# EAGLE design ATTAMI-Shield-serial (EAGLE 7.1.0)
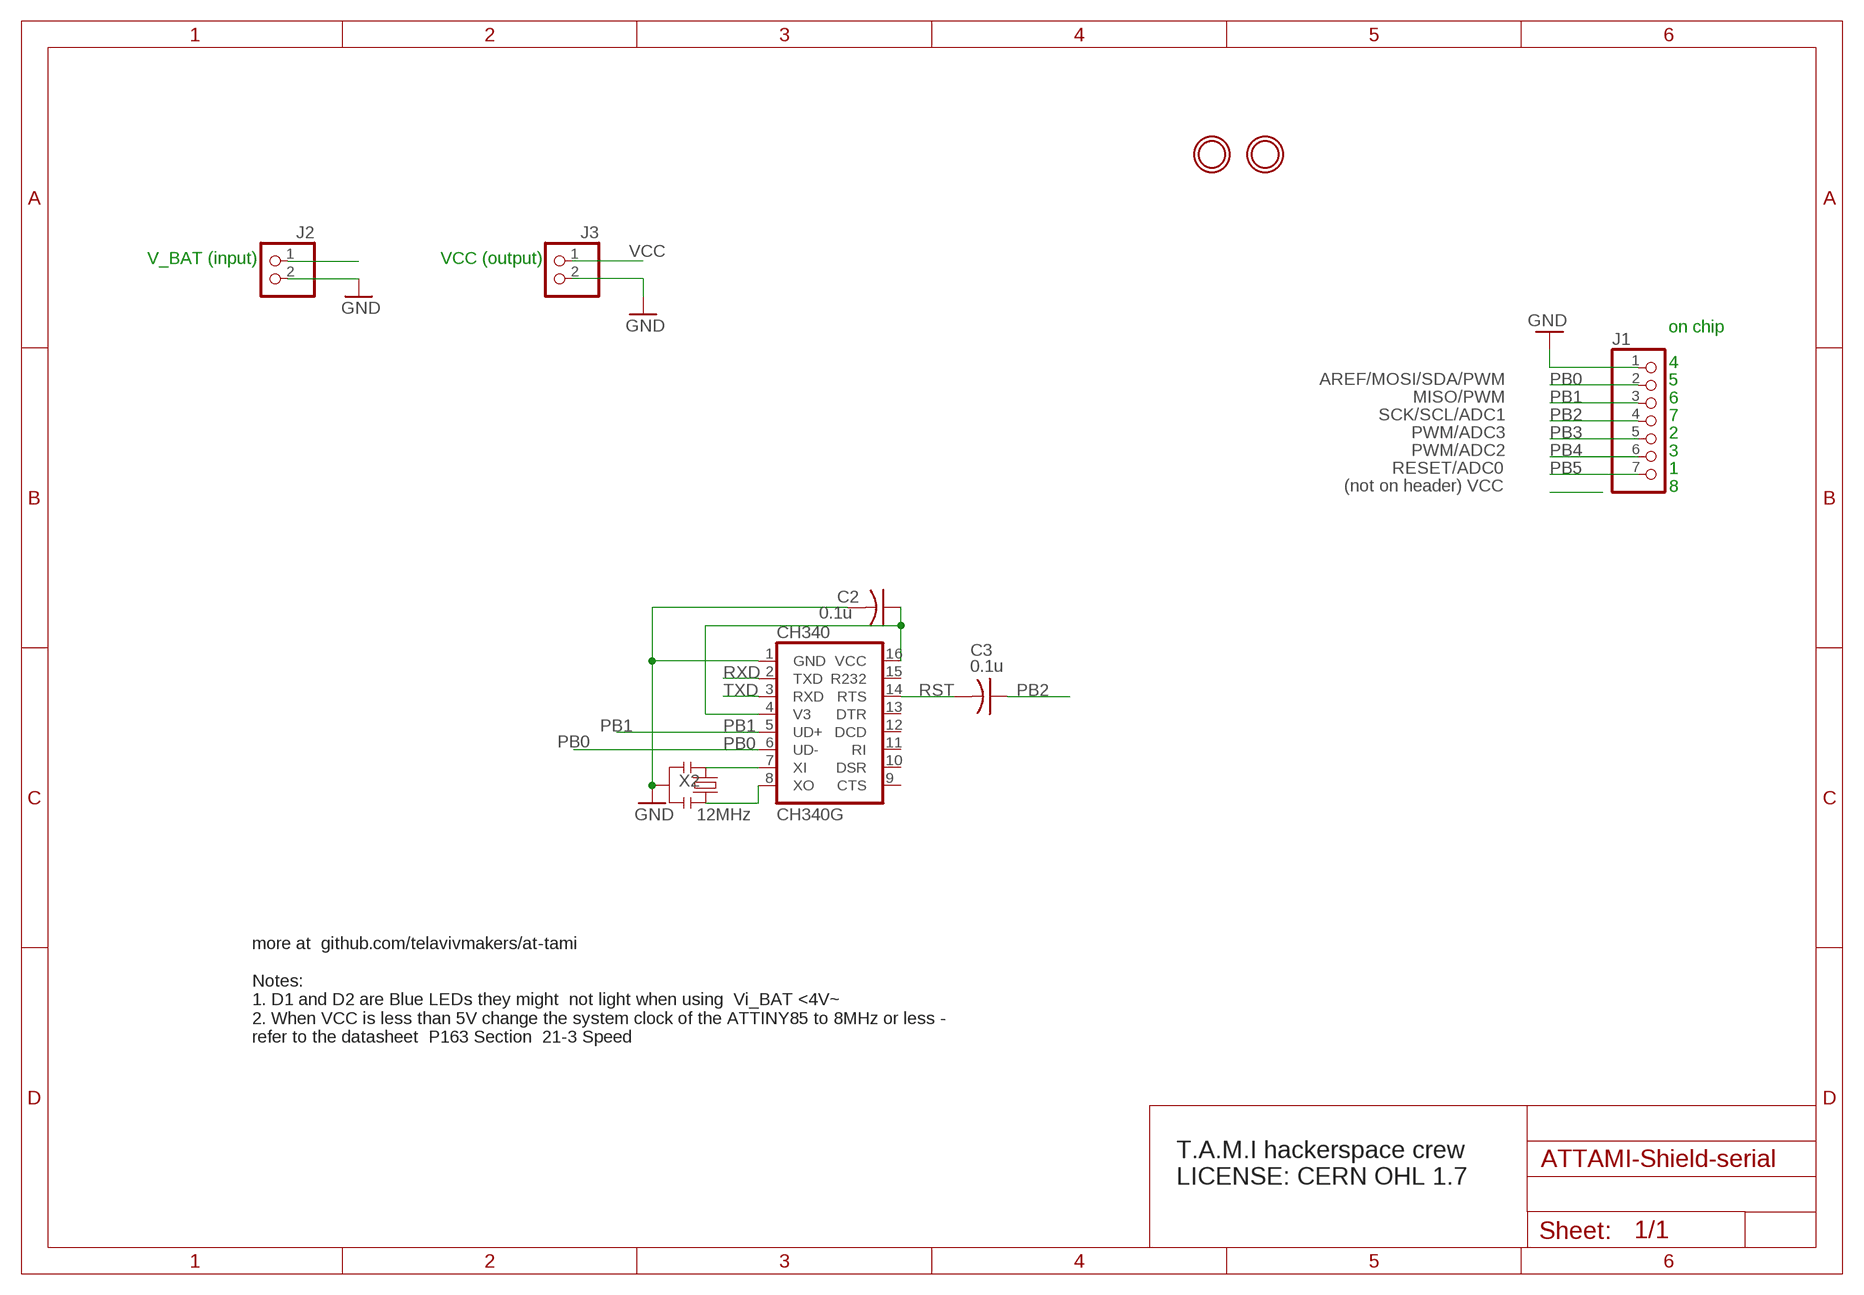
[diagram p0: schematic, sheet 1]

## Parts
C2  0.1u  C-USC0603  [C0603]
C3  0.1u  C-USC0603  [C0603]
CH340  CH340G  [SO16]
J1  HEADER-1X7ROUND  [1X07_ROUND]
J2  HEADER-1X2ROUND  [1X02_ROUND]
J3  HEADER-1X2ROUND  [1X02_ROUND]
U$1  MOUNTINGHOLE2.0  [MOUNTINGHOLE_2.0_PLATED]
U$2  MOUNTINGHOLE2.0  [MOUNTINGHOLE_2.0_PLATED]
X2  12MHz  RESONATORSMD  [RESONATOR-SMD]

## Nets
GND: C2.2 CH340.1(GND) J1.1 J2.2 J3.2 X2.2
N$3: J2.1
N$11: CH340.7(XI) X2.1
N$13: CH340.8(XO) X2.3
PB0: CH340.6(UD-) J1.2
PB1: CH340.5(UD+) J1.3
PB2: C3.1 J1.4
PB3: J1.5
PB4: J1.6
PB5: J1.7
RST: C3.2 CH340.14(RTS)
RXD: CH340.2(TXD)
TXD: CH340.3(RXD)
VCC: C2.1 CH340.4(V3) CH340.16(VCC) J3.1
Unconnected: CH340.9(CTS) CH340.10(DSR) CH340.11(RI) CH340.12(DCD) CH340.13(DTR) CH340.15(R232)

## Notes on the sheet
- V_BAT (input) | VCC (output)
- AREF/MOSI/SDA/PWM
- MISO/PWM
- SCK/SCL/ADC1
- PWM/ADC3
- PWM/ADC2
- RESET/ADC0
- (not on header) VCC
- on chip
  
  4
  5
  6
  7
  2
  3
  1
  8
- more at  github.com/telavivmakers/at-tami
  
  Notes: 
  1. D1 and D2 are Blue LEDs they might  not light when using  Vi_BAT <4V~  
  2. When VCC is less than 5V change the system clock of the ATTINY85 to 8MHz or less - 
  refer to the datasheet  P163 Section  21-3 Speed
- T.A.M.I hackerspace crew 
  LICENSE: CERN OHL 1.7

## Library data of the parts
C2 C3 = adafruit:C-US: CAPACITOR, American symbol
CH340 = SparkFunNew:CH340
J1 = ATtami:HEADER-1X7: PIN HEADER
J2 J3 = ATtami:HEADER-1X2: PIN HEADER
U$1 U$2 = ATtami:MOUNTINGHOLE: Mounting Hole For #2 screws (0.086"/2.18mm width, 0.094"/2.4mm hole) use 2.5mm
X2 = SparkFunNew:RESONATOR: Resonator Small SMD resonator. This is the itty bitty 10/20MHz resonators with built in caps. CSTCE10M0G55 and CSTCE20M0V53. Footprint has been reviewed closely but hasn't been tested yet.

## Net classes
0 default: width 0.178 mm, clearance 0.178 mm
1 power: width 0.305 mm, clearance 0.203 mm

## Board
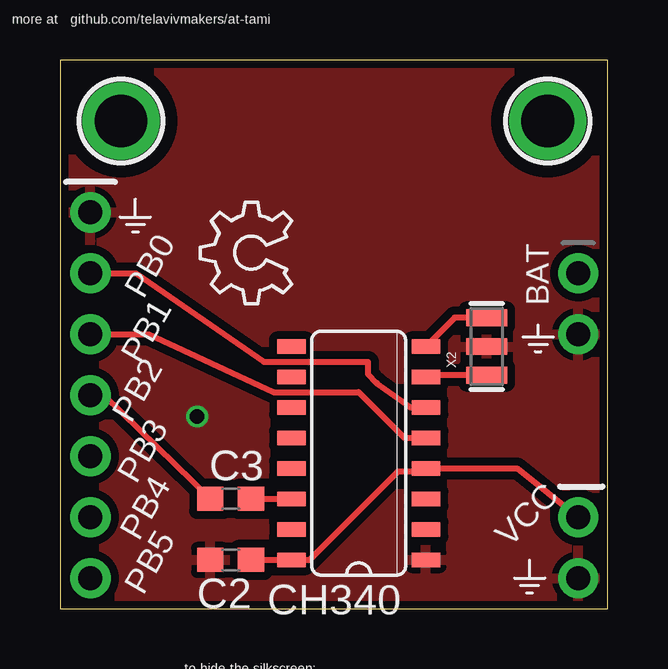
[diagram p1: board, top side]
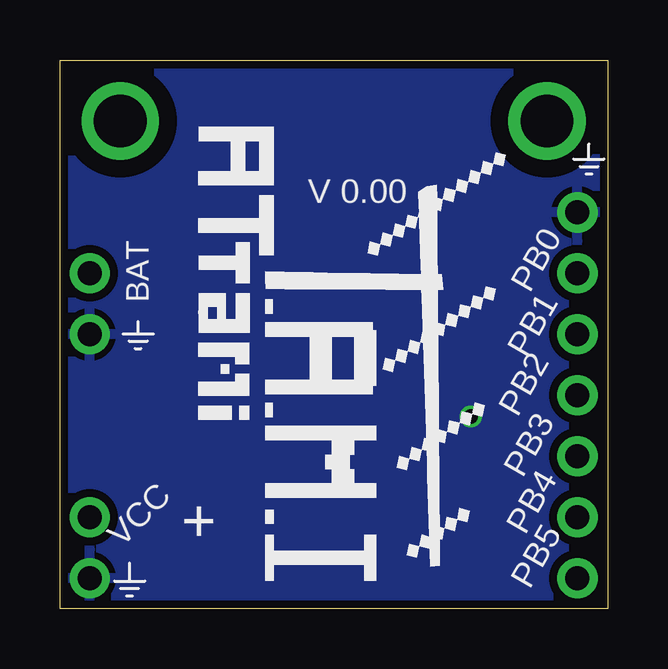
[diagram p2: board, bottom side, seen from below]

Size 22.83 x 22.86 mm. Coordinates in mm from the lower left corner, seen from the top.
Outline: 0,0 22.83,0 22.83,22.86 0,22.86 0,0
Copper layers (1*16): Top 0.035mm / dielectric 1.5mm / Bottom 0.035mm
Design rules "dirt_cheap_dirty_boards.v1": minimum track width 5mil, minimum drill 12mil, track to track 5mil, track to pad 5mil, pad to pad 5mil, via to via 5mil, smd to smd 0mil, copper to edge 10mil, drill to drill 10mil, minimum pad ring 10mil, minimum via ring 6mil, stop-mask expansion 2mil, vias tented up to drill 25mil, thermal gap 10mil

### Footprints (pad centres in the part's own frame; a part is rotated, then mirrored left to right if it is on the bottom)
C0603 = smd 1.1 x 1: 1 -0.85,0; 2 0.85,0
SO16 = smd 0.6 x 1.2: 1 -4.445,-2.8; 2 -3.175,-2.8; 3 -1.905,-2.8; 4 -0.635,-2.8; 5 0.635,-2.8; 6 1.905,-2.8; 7 3.175,-2.8; 8 4.445,-2.8; 9 4.445,2.8; 10 3.175,2.8; 11 1.905,2.8; 12 0.635,2.8; 13 -0.635,2.8; 14 -1.905,2.8; 15 -3.175,2.8; 16 -4.445,2.8
1X07_ROUND = drill 1 pad 1.676: 1 -7.62,0; 2 -5.08,0; 3 -2.54,0; 4 0,0; 5 2.54,0; 6 5.08,0; 7 7.62,0
1X02_ROUND = drill 1 pad 1.676: 1 -1.27,0; 2 1.27,0
MOUNTINGHOLE_2.0_PLATED = drill 2.2 pad 3: P$1 0,0
RESONATOR-SMD = smd 0.7 x 1.7: 1 -1.2,0; 2 0,0; 3 1.2,0

### Placement (x,y rotation side)
C2  7.11,2.03 180 top
C3  7.11,4.57 0 top
CH340  12.45,6.48 90 top
J1  1.27,8.89 270 top
J2  21.59,12.7 270 top
J3  21.59,2.54 270 top
U$1  2.54,20.32 270 top
U$2  20.32,20.32 0 top
U$3  [OSHW_6X150_NOTEXT]  9.65,12.7 90 top
X2  17.78,10.92 90 top

### Tracks (layer width: path | path; a pad name or v marks a point on that pad's centre or on a via)
GND  (via drill 0.6)
  other vias: 5.71,8
  pour Bottom (isolate 0.33): 23.37,23.75 -1.52,23.62 -1.21,-1.43 23.37,-1.02
  pour Top (isolate 0.33): -1.02,23.5 -1.02,-0.51 23.62,-0.51 23.3,23.53
N$11
  Top 0.254: X2.1 15.32,9.72 CH340.7
N$13
  Top 0.254: X2.3 16.45,12.12 CH340.8
PB0
  Top 0.254: J1.2 3.17,13.97 8.51,10.29 12.83,10.29 12.83,9.78 13.21,9.4 14.61,8.38 CH340.6
PB1
  Top 0.254: J1.3 3.68,11.43 8.89,9.02 12.45,9.02 14.35,7.11 CH340.5
PB2
  Top 0.254: J1.4 1.82,8.89 C3.1
RST
  Top 0.254: C3.2 CH340.14
VCC
  Top 0.254: J3.1 19.05,5.84 CH340.4 15.12,5.71 14.1,5.71 10.41,2.03 CH340.16 C2.1

### Text on the board
tPlace: more at github.com/telavivmakers/at-tami | to hide the silkscreen: / disable layers: tNames, bNames, tPlace, bPlace
bPlace: V 0.00 | BAT | PB0 | PB1 | PB2 | PB3 | PB4 | + | VCC | PB5
tNames: BAT | PB0 | PB1 | PB2 | PB3 | PB4 | VCC | PB5
tTest: J2